# Altium schematic sheet C-06 BOOT CFG.SchDoc
size 513 x 386 mm
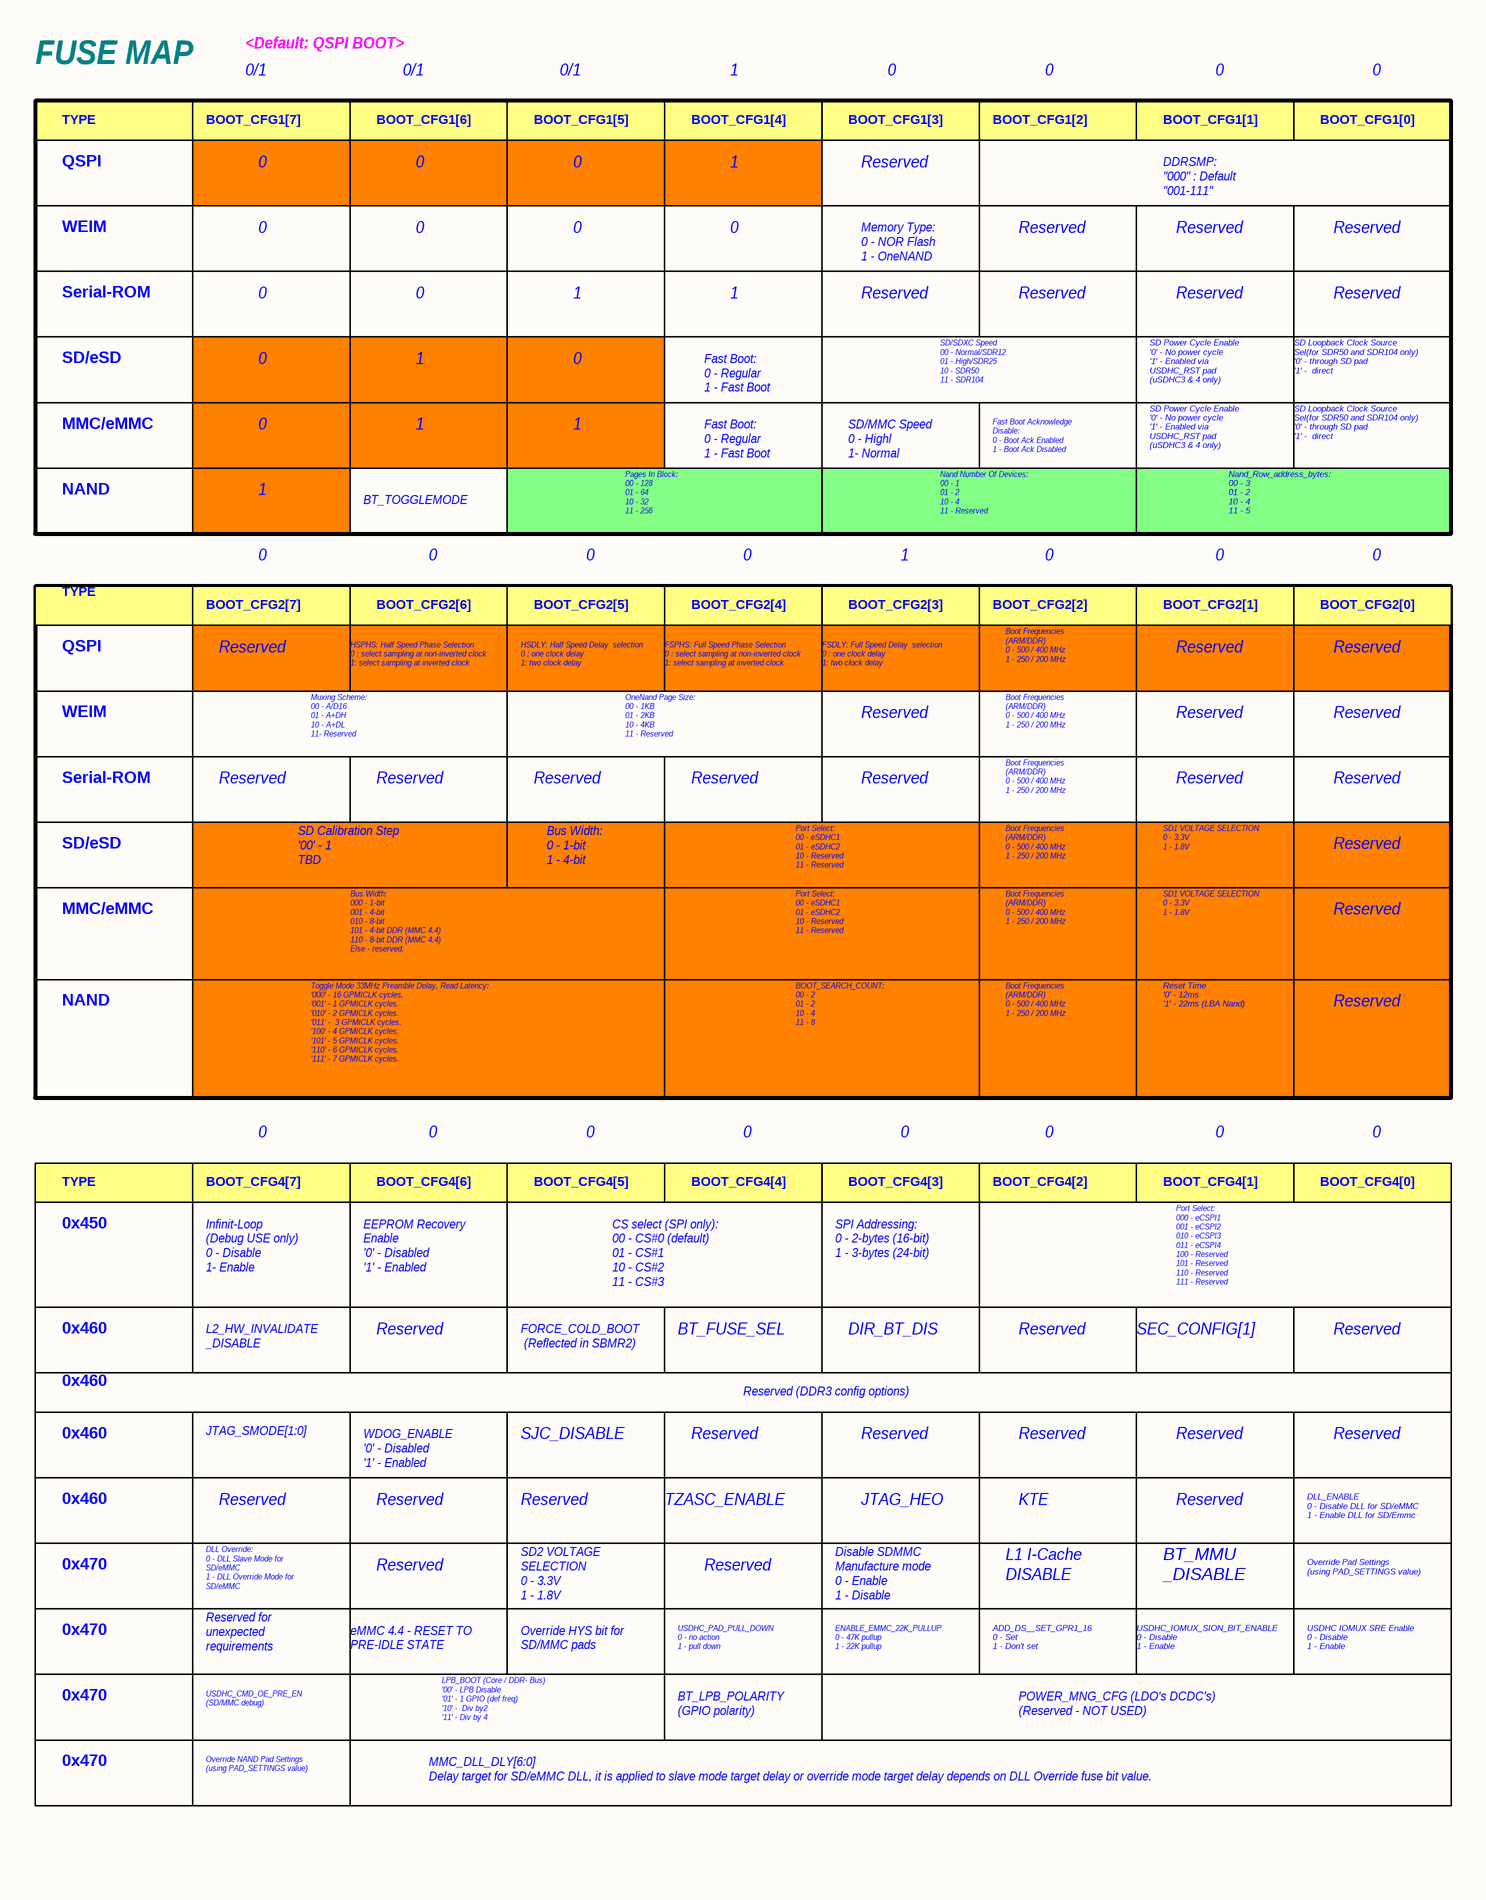
[diagram p0: C-06 BOOT CFG.SchDoc, left]
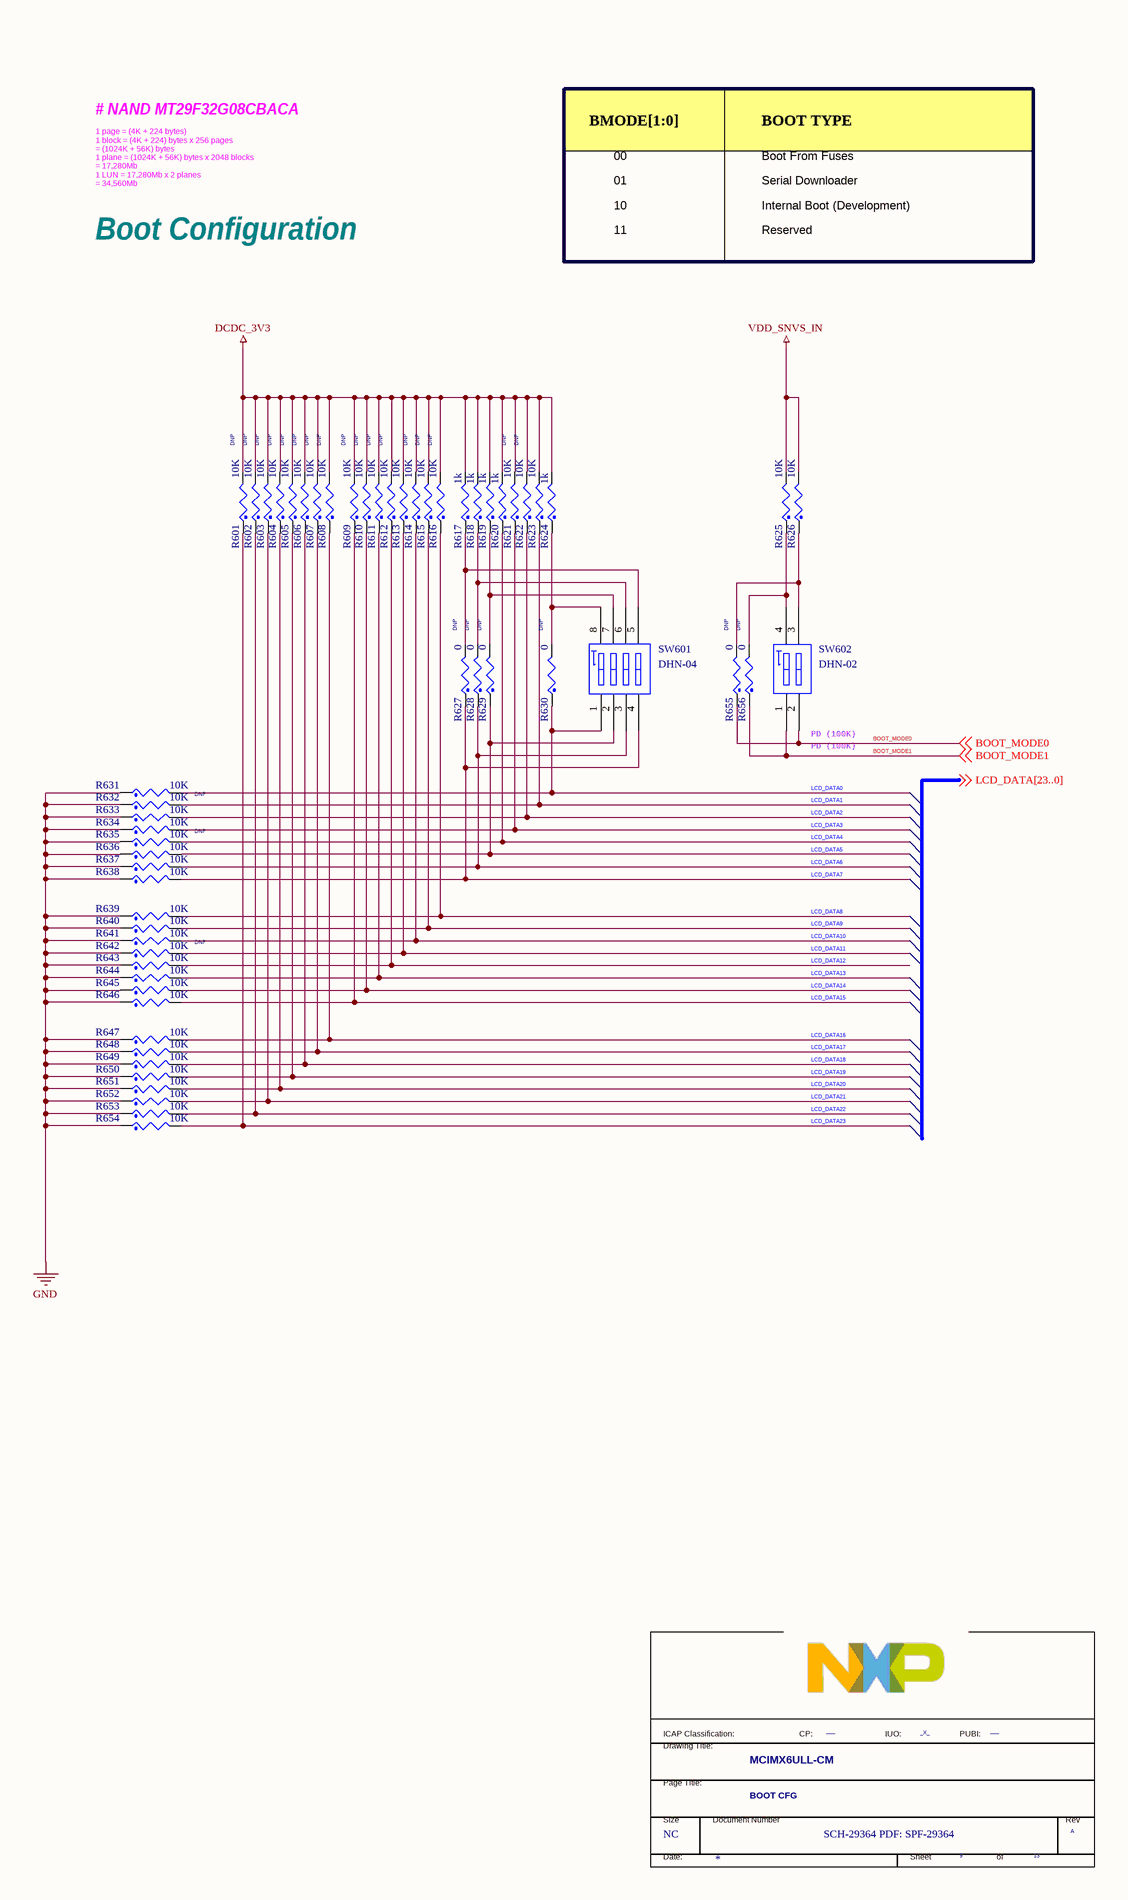
[diagram p1: C-06 BOOT CFG.SchDoc, right]

## Parts
*  FIUO: _X_  PUBI: ___  Doc: SCH-29364 PDF: SPF-29364  RevCode: A  Title: MCIMX6ULL-CM  Page Size: NC  Page Number: 9  Page Count: 13  PageTitle: BOOT CFG  (hidden comment: TitleBlock_FS)  (graphical)
R601  10K  ASSY_OPT: DNP  [R0402_H0.35mm]
R602  10K  ASSY_OPT: DNP  [R0402_H0.35mm]
R603  10K  ASSY_OPT: DNP  [R0402_H0.35mm]
R604  10K  ASSY_OPT: DNP  [R0402_H0.35mm]
R605  10K  ASSY_OPT: DNP  [R0402_H0.35mm]
R606  10K  ASSY_OPT: DNP  [R0402_H0.35mm]
R607  10K  ASSY_OPT: DNP  [R0402_H0.35mm]
R608  10K  ASSY_OPT: DNP  [R0402_H0.35mm]
R609  10K  ASSY_OPT: DNP  [R0402_H0.35mm]
R610  10K  ASSY_OPT: DNP  [R0402_H0.35mm]
R611  10K  ASSY_OPT: DNP  [R0402_H0.35mm]
R612  10K  ASSY_OPT: DNP  [R0402_H0.35mm]
R613  10K  [R0402_H0.35mm]
R614  10K  ASSY_OPT: DNP  [R0402_H0.35mm]
R615  10K  ASSY_OPT: DNP  [R0402_H0.35mm]
R616  10K  ASSY_OPT: DNP  [R0402_H0.35mm]
R617  1k  [R0402_H0.35mm]
R618  1k  [R0402_H0.35mm]
R619  1k  [R0402_H0.35mm]
R620  1k  [R0402_H0.35mm]
R621  10K  ASSY_OPT: DNP  [R0402_H0.35mm]
R622  10K  ASSY_OPT: DNP  [R0402_H0.35mm]
R623  10K  [R0402_H0.35mm]
R624  1k  [R0402_H0.35mm]
R625  10K  [R0402_H0.35mm]
R626  10K  [R0402_H0.35mm]
R627  0  ASSY_OPT: DNP  [R0402_H0.35mm]
R628  0  ASSY_OPT: DNP  [R0402_H0.35mm]
R629  0  ASSY_OPT: DNP  [R0402_H0.35mm]
R630  0  ASSY_OPT: DNP  [R0402_H0.35mm]
R631  10K  [R0402_H0.35mm]
R632  10K  ASSY_OPT: DNP  [R0402_H0.35mm]
R633  10K  [R0402_H0.35mm]
R634  10K  [R0402_H0.35mm]
R635  10K  ASSY_OPT: DNP  [R0402_H0.35mm]
R636  10K  [R0402_H0.35mm]
R637  10K  [R0402_H0.35mm]
R638  10K  [R0402_H0.35mm]
R639  10K  [R0402_H0.35mm]
R640  10K  [R0402_H0.35mm]
R641  10K  [R0402_H0.35mm]
R642  10K  ASSY_OPT: DNP  [R0402_H0.35mm]
R643  10K  [R0402_H0.35mm]
R644  10K  [R0402_H0.35mm]
R645  10K  [R0402_H0.35mm]
R646  10K  [R0402_H0.35mm]
R647  10K  [R0402_H0.35mm]
R648  10K  [R0402_H0.35mm]
R649  10K  [R0402_H0.35mm]
R650  10K  [R0402_H0.35mm]
R651  10K  [R0402_H0.35mm]
R652  10K  [R0402_H0.35mm]
R653  10K  [R0402_H0.35mm]
R654  10K  [R0402_H0.35mm]
R655  0  ASSY_OPT: DNP  [R0402_H0.35mm]
R656  0  ASSY_OPT: DNP  [R0402_H0.35mm]
SW601  DHN-04  [DHN-04-V]
SW602  DHN-02  [DHN-02-V]

## Nets
DCDC_3V3: R601.2 R602.2 R603.2 R604.2 R605.2 R606.2 R607.2 R608.2 R609.2 R610.2 R611.2 R612.2 R613.2 R614.2 R615.2 R616.2 R617.2 R618.2 R619.2 R620.2 R621.2 R622.2 R623.2 R624.2
GND: R631.1 R632.1 R633.1 R634.1 R635.1 R636.1 R637.1 R638.1 R639.1 R640.1 R641.1 R642.1 R643.1 R644.1 R645.1 R646.1 R647.1 R648.1 R649.1 R650.1 R651.1 R652.1 R653.1 R654.1
VDD_SNVS_IN: R625.2 R626.2
BOOT_MODE0: R655.1 SW602.2(A2) ; off-sheet BOOT_MODE0
BOOT_MODE1: R656.1 SW602.1(A1) ; off-sheet BOOT_MODE1
LCD_DATA0: R630.1 R631.2 SW601.1(A1)
LCD_DATA1: R623.1 R632.2
LCD_DATA2: R622.1 R633.2
LCD_DATA3: R621.1 R634.2
LCD_DATA4: R620.1 R635.2
LCD_DATA5: R629.1 R636.2 SW601.2(A2)
LCD_DATA6: R628.1 R637.2 SW601.3(A3)
LCD_DATA7: R627.1 R638.2 SW601.4(A4)
LCD_DATA8: R616.1 R639.2
LCD_DATA9: R615.1 R640.2
LCD_DATA10: R614.1 R641.2
LCD_DATA11: R613.1 R642.2
LCD_DATA12: R612.1 R643.2
LCD_DATA13: R611.1 R644.2
LCD_DATA14: R610.1 R645.2
LCD_DATA15: R609.1 R646.2
LCD_DATA16: R608.1 R647.2
LCD_DATA17: R607.1 R648.2
LCD_DATA18: R606.1 R649.2
LCD_DATA19: R605.1 R650.2
LCD_DATA20: R604.1 R651.2
LCD_DATA21: R603.1 R652.2
LCD_DATA22: R602.1 R653.2
LCD_DATA23: R601.1 R654.2
NetR617_1: R617.1 R627.2 SW601.5(B4)
NetR618_1: R618.1 R628.2 SW601.6(B3)
NetR619_1: R619.1 R629.2 SW601.7(B2)
NetR624_1: R624.1 R630.2 SW601.8(B1)
NetR625_1: R625.1 R656.2 SW602.4(B1)
NetR626_1: R626.1 R655.2 SW602.3(B2)

## Notes on the sheet
- <Default: QSPI BOOT>
- FUSE MAP
- TYPE
- BOOT_CFG1[7]
- 0/1
- BOOT_CFG1[6]
- BOOT_CFG1[5]
- BOOT_CFG1[4]
- 1
- BOOT_CFG1[3]
- 0
- BOOT_CFG1[2]
- BOOT_CFG1[1]
- BOOT_CFG1[0]
- QSPI
- Reserved
- # NAND MT29F32G08CBACA
- BMODE[1:0]
- 00
- BOOT TYPE
- Boot From Fuses
- WEIM
- DDRSMP:
  "000" : Default
  "001-111"
- 1 page = (4K + 224 bytes)
  1 block = (4K + 224) bytes x 256 pages
  = (1024K + 56K) bytes
  1 plane = (1024K + 56K) bytes x 2048 blocks
  = 17,280Mb
  1 LUN = 17,280Mb x 2 planes
  = 34,560Mb
- 01
- 10
- 11
- Serial Downloader
- Internal Boot (Development)
- Serial-ROM
- Memory Type:
  0 - NOR Flash
  1 - OneNAND
- Boot Configuration
- SD/eSD
- SD Power Cycle Enable
  '0' - No power cycle
  '1' - Enabled via
  USDHC_RST pad
  (uSDHC3 & 4 only)
- SD Loopback Clock Source
  Sel(for SDR50 and SDR104 only)
  '0' - through SD pad
  '1' -  direct
- MMC/eMMC
- Fast Boot:
  0 - Regular
  1 - Fast Boot
- SD/SDXC Speed
  00 - Normal/SDR12
  01 - High/SDR25
  10 - SDR50
  11 - SDR104
- NAND
- BT_TOGGLEMODE
- SD/MMC Speed
  0 - Highl
  1- Normal
- Fast Boot Acknowledge
  Disable:
  0 - Boot Ack Enabled
  1 - Boot Ack Disabled
- Nand_Row_address_bytes:
  00 - 3
  01 - 2
  10 - 4
  11 - 5
- Pages In Block:
  00 - 128
  01 - 64
  10 - 32
  11 - 256
- Nand Number Of Devices:
  00 - 1
  01 - 2
  10 - 4
  11 - Reserved
- BOOT_CFG2[7]
- BOOT_CFG2[6]
- BOOT_CFG2[5]
- BOOT_CFG2[4]
- BOOT_CFG2[3]
- BOOT_CFG2[2]
- BOOT_CFG2[1]
- BOOT_CFG2[0]
- HSPHS: Half Speed Phase Selection
  0 : select sampling at non-inverted clock
  1: select sampling at inverted clock
- HSDLY: Half Speed Delay  selection
  0 : one clock delay
  1: two clock delay
- FSPHS: Full Speed Phase Selection
  0 : select sampling at non-inverted clock
  1: select sampling at inverted clock
- FSDLY: Full Speed Delay  selection
  0 : one clock delay
  1: two clock delay
- Boot Frequencies
  (ARM/DDR)
  0 - 500 / 400 MHz
  1 - 250 / 200 MHz
- Muxing Scheme:
  00 - A/D16
  01 - A+DH
  10 - A+DL
  11- Reserved
- OneNand Page Size:
  00 - 1KB
  01 - 2KB
  10 - 4KB
  11 - Reserved
- PD (100K)
- (near SW602) PD (100K)
- SD Calibration Step
  '00' - 1
  TBD
- Bus Width:
  0 - 1-bit
  1 - 4-bit
- Port Select:
  00 - eSDHC1
  01 - eSDHC2
  10 - Reserved
  11 - Reserved
- SD1 VOLTAGE SELECTION
  0 - 3.3V
  1 - 1.8V
- Bus Width:
  000 - 1-bit
  001 - 4-bit
  010 - 8-bit
  101 - 4-bit DDR (MMC 4.4)
  110 - 8-bit DDR (MMC 4.4)
  Else - reserved.
- BOOT_SEARCH_COUNT:
  00 - 2
  01 - 2
  10 - 4
  11 - 8
- Reset Time
  '0' - 12ms
  '1' - 22ms (LBA Nand)
- Toggle Mode 33MHz Preamble Delay, Read Latency:
  '000' - 16 GPMICLK cycles.
  '001' - 1 GPMICLK cycles.
  '010' - 2 GPMICLK cycles.
  '011' -  3 GPMICLK cycles.
  '100' - 4 GPMICLK cycles.
  '101' - 5 GPMICLK cycles.
  '110' - 6 GPMICLK cycles.
  '111' - 7 GPMICLK cycles.
- 0x450
- BOOT_CFG4[7]
- BOOT_CFG4[6]
- BOOT_CFG4[5]
- BOOT_CFG4[4]
- BOOT_CFG4[3]
- BOOT_CFG4[2]
- BOOT_CFG4[1]
- BOOT_CFG4[0]
- Infinit-Loop
  (Debug USE only)
  0 - Disable
  1- Enable
- EEPROM Recovery
  Enable
  '0' - Disabled
  '1' - Enabled
- CS select (SPI only):
  00 - CS#0 (default)
  01 - CS#1
  10 - CS#2
  11 - CS#3
- SPI Addressing:
  0 - 2-bytes (16-bit)
  1 - 3-bytes (24-bit)
- Port Select:
  000 - eCSPI1
  001 - eCSPI2
  010 - eCSPI3
  011 - eCSPI4
  100 - Reserved
  101 - Reserved
  110 - Reserved
  111 - Reserved
- 0x460
- L2_HW_INVALIDATE
  _DISABLE
- FORCE_COLD_BOOT
  (Reflected in SBMR2)
- BT_FUSE_SEL
- DIR_BT_DIS
- SEC_CONFIG[1]
- JTAG_SMODE[1:0]
- Reserved (DDR3 config options)
- WDOG_ENABLE
  '0' - Disabled
  '1' - Enabled
- SJC_DISABLE
- TZASC_ENABLE
- JTAG_HEO
- KTE
- 0x470
- DLL_ENABLE
  0 - Disable DLL for SD/eMMC
  1 - Enable DLL for SD/Emmc
- DLL Override:
  0 - DLL Slave Mode for
  SD/eMMC
  1 - DLL Override Mode for
  SD/eMMC
- SD2 VOLTAGE
  SELECTION
  0 - 3.3V
  1 - 1.8V
- Disable SDMMC
  Manufacture mode
  0 - Enable
  1 - Disable
- L1 I-Cache
  DISABLE
- BT_MMU
  _DISABLE
- Override Pad Settings
  (using PAD_SETTINGS value)
- Reserved for
  unexpected
  requirements
- eMMC 4.4 - RESET TO
  PRE-IDLE STATE
- Override HYS bit for
  SD/MMC pads
- USDHC_PAD_PULL_DOWN
  0 - no action
  1 - pull down
- ENABLE_EMMC_22K_PULLUP
  0 - 47K pullup
  1 - 22K pullup
- ADD_DS__SET_GPR1_16
  0 - Set
  1 - Don't set
- USDHC_IOMUX_SION_BIT_ENABLE
  0 - Disable
  1 - Enable
- USDHC IOMUX SRE Enable
  0 - Disable
  1 - Enable
- USDHC_CMD_OE_PRE_EN
  (SD/MMC debug)
- LPB_BOOT (Core / DDR- Bus)
  '00' - LPB Disable
  '01' - 1 GPIO (def freq)
  '10' -  Div by2
  '11' - Div by 4
- BT_LPB_POLARITY
  (GPIO polarity)
- POWER_MNG_CFG (LDO's DCDC's)
  (Reserved - NOT USED)
- Override NAND Pad Settings
  (using PAD_SETTINGS value)
- MMC_DLL_DLY[6:0]
  Delay target for SD/eMMC DLL, it is applied to slave mode target delay or override mode target delay depends on DLL Override fuse bit value.
- (in symbol TitleBlock_FS) ICAP Classification:; CP:; IUO:; PUBI:; Drawing Title:; Page Title:; Size; Document Number; Rev; Date:; Sheet; of

## Library data of the parts
* = TitleBlock_FS: OrgAddr2: Austin, TX 78735-8598; OrgAddr1: 6501 William Cannon Drive West; OrgName: Freescale Semiconductor; FCP: ___; Page Create Date: March  8, 1995; Page Modify Date: *
R601 R613 R625 R626 R632 = RES: RES MF 10K 1/16W 5% 0402; CLASS: DISCRETE; AGILE_PN: 470-75557; MFG_NAME01: VISHAY INTERTECHNOLOGY; MFG_PN01: CRCW040210K0JNED; CAD_APPROVED: Yes; FPLIST: RC0402_25,RC0402_HD,0402_CC; PCB Footprint: 0402_CC; HEIGHT: 0.4 MM; TOL: 5%; Tolerance: 5%; ROHS: Yes
R602-R612 R614-R616 R621-R623 R631 R633-R654 = RES: RES MF 10K 1/16W 5% 0402; CLASS: DISCRETE; FPLIST: RC0402_25,RC0402_HD,0402_CC; CAD_APPROVED: Yes; MFG_PN01: CRCW040210K0JNED; MFG_NAME01: VISHAY INTERTECHNOLOGY; AGILE_PN: 470-75557; PCB Footprint: 0402_CC; ROHS: Yes; Tolerance: 5%; TOL: 5%; HEIGHT: 0.4 MM
R617 = RES: RES MF 1.0K 1/16W 5% 0402; CLASS: DISCRETE; AGILE_PN: 470-75555; MFG_NAME01: VISHAY INTERTECHNOLOGY; MFG_PN01: CRCW04021K00JNED; CAD_APPROVED: Yes; FPLIST: RC0402_25,RC0402_HD,RC0402_X2,0402_CC; PCB Footprint: 0402_CC; Tolerance: 5%; ROHS: Yes
R618-R620 R624 = RES: RES MF 1.0K 1/16W 5% 0402; CLASS: DISCRETE; FPLIST: RC0402_25,RC0402_HD,RC0402_X2,0402_CC; CAD_APPROVED: Yes; MFG_PN01: CRCW04021K00JNED; MFG_NAME01: VISHAY INTERTECHNOLOGY; AGILE_PN: 470-75555; PCB Footprint: 0402_CC; ROHS: Yes; Tolerance: 5%
R627-R630 R656 = RES: RES MF ZERO OHM 1/16W 5% 0402; CLASS: DISCRETE; FPLIST: RC0402_25,RC0402_HD,RC0402_X2,0402_CC; CAD_APPROVED: Yes; MFG_PN01: MCR01MZPJ000; MFG_NAME01: ROHM; AGILE_PN: 470-75394; PCB Footprint: 0402_CC; ROHS: Yes; Tolerance: 5%
R655 = RES: RES MF ZERO OHM 1/16W 5% 0402; CLASS: DISCRETE; AGILE_PN: 470-75394; MFG_NAME01: ROHM; MFG_PN01: MCR01MZPJ000; CAD_APPROVED: Yes; FPLIST: RC0402_25,RC0402_HD,RC0402_X2,0402_CC; PCB Footprint: 0402_CC; Tolerance: 5%; ROHS: Yes
SW601 = SW_DIP-4_SM: SW 4P SPST DIP 25MA 24V SMT; CLASS: IC; AGILE_PN: 510-77990; MFG_NAME01: DIPTRONICS MANUFACTURING; CAD_APPROVED: Yes; PCB Footprint: 97C04; MFG_PN01: DHN-04-V; ROHS: Yes; HEIGHT: 1.65 MM
SW602 = SW_DIP-2: SW 2P SPST DIP 25MA 24V SMT; CLASS: IC; AGILE_PN: 510-77991; MFG_NAME01: DIPTRONICS MANUFACTURING; CAD_APPROVED: Yes; PCB Footprint: sw_dip2_sm; MFG_PN01: DHN-02-V; ROHS: Yes; HEIGHT: 1.65 MM